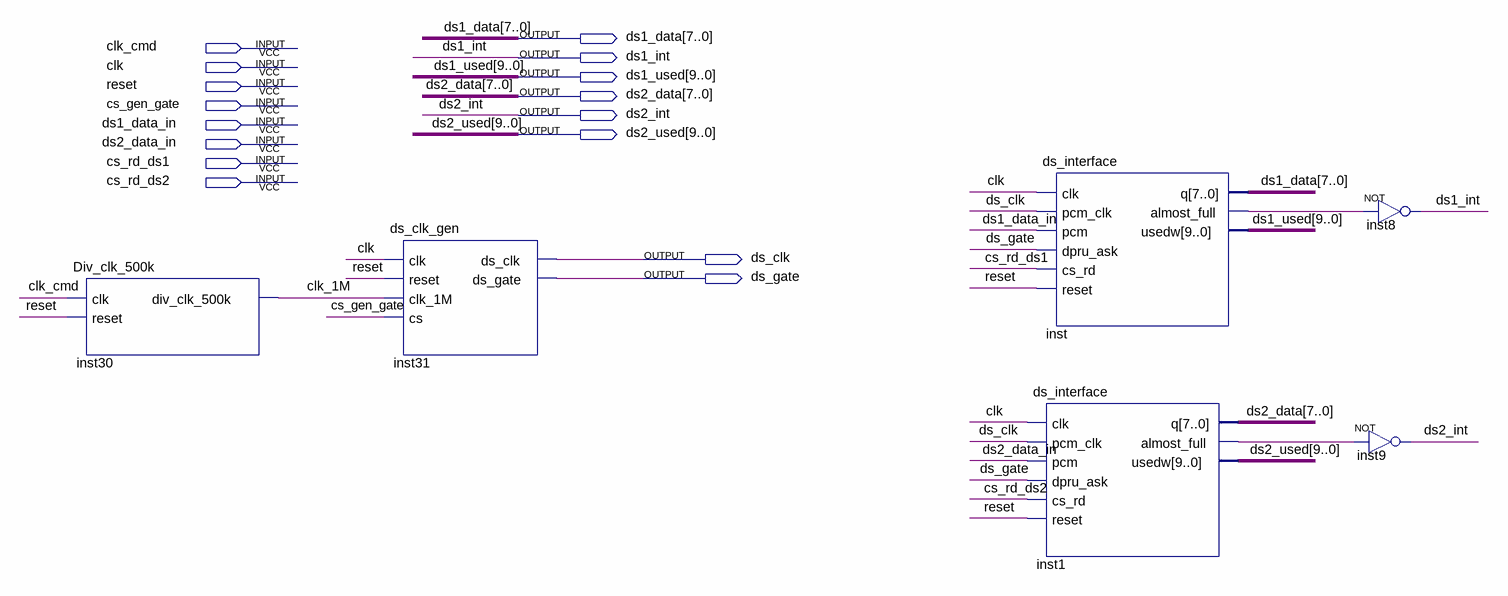
[diagram p0: schematic sheet]
// Quartus schematic DS_Module.bdf as structural Verilog: 6 symbols, 16 pins
module DS_Module (
  input  clk_cmd,
  input  clk,
  input  reset,
  input  cs_gen_gate,
  input  ds1_data_in,
  input  ds2_data_in,
  input  cs_rd_ds1,
  input  cs_rd_ds2,
  output [7:0] ds1_data,
  output ds1_int,
  output [9:0] ds1_used,
  output [7:0] ds2_data,
  output ds2_int,
  output [9:0] ds2_used,
  output ds_clk,
  output ds_gate
);

  wire clk_1M, inst1_almost_full, inst_almost_full;

  Div_clk_500k inst30 (.clk(clk_cmd), .reset(reset), .div_clk_500k(clk_1M));
  ds_clk_gen inst31 (.clk(clk), .reset(reset), .clk_1M(clk_1M), .cs(cs_gen_gate), .ds_clk(ds_clk), .ds_gate(ds_gate));
  ds_interface inst (
    .clk(clk), .pcm_clk(ds_clk), .pcm(ds1_data_in), .dpru_ask(ds_gate), .cs_rd(cs_rd_ds1), .reset(reset),
    .q(ds1_data), .almost_full(inst_almost_full), .usedw(ds1_used));
  ds_interface inst1 (
    .clk(clk), .pcm_clk(ds_clk), .pcm(ds2_data_in), .dpru_ask(ds_gate), .cs_rd(cs_rd_ds2), .reset(reset),
    .q(ds2_data), .almost_full(inst1_almost_full), .usedw(ds2_used));
  not inst8 (ds1_int, inst_almost_full);
  not inst9 (ds2_int, inst1_almost_full);
endmodule
